# Altium schematic sheet 05_CSI_CAMERA.SchDoc: MIP CSI Camera Connector
size 297 x 209 mm; Author: T. Ludemann; SheetNumber: 5; SheetTotal: 5; DocSize: DINA4
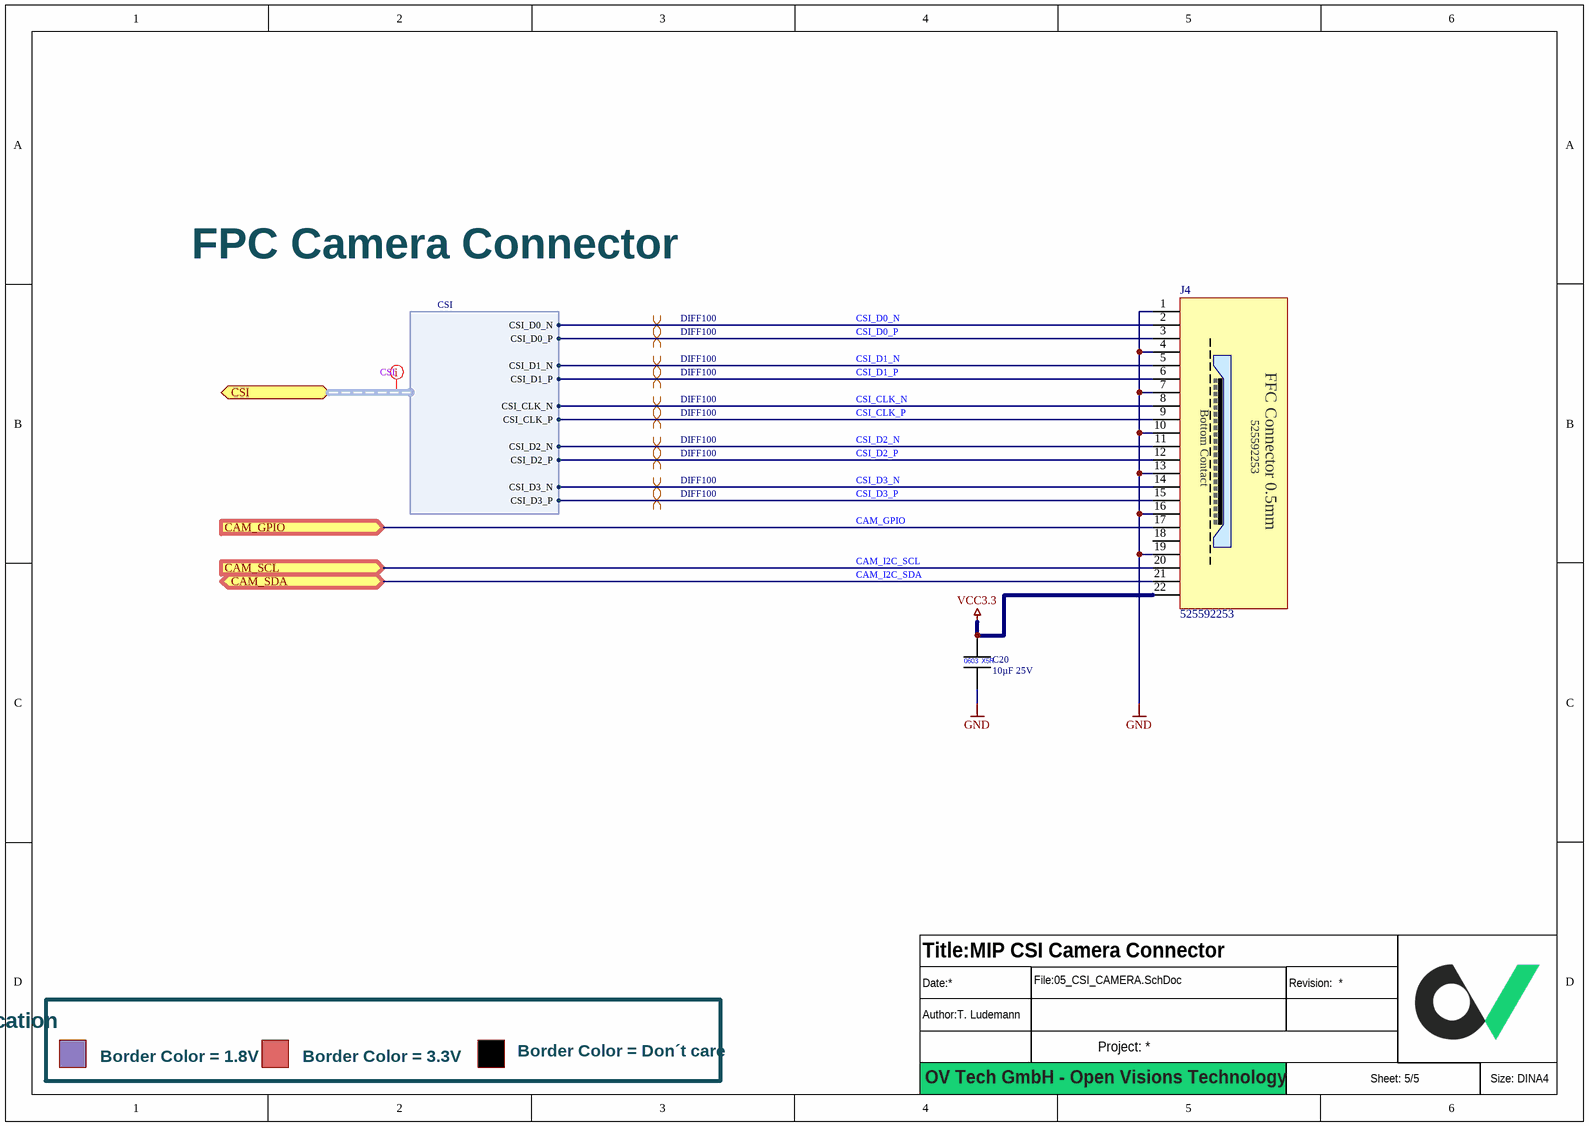
[diagram p0: 05_CSI_CAMERA.SchDoc]

## Parts
?  (no value)  (graphical)
C20  10µF 25V  [CAPC1608X10L]
J4  525592253  [FFC 22pol 0.5mm 525592253]

## Ports
CAM_GPIO (in), CAM_SCL (in), CAM_SDA (bidir), CSI (bidir, harness CSI)

## Harnesses
CSI: CSI_D0_N, CSI_D0_P, CSI_D1_N, CSI_D1_P, CSI_CLK_N, CSI_CLK_P, CSI_D2_N, CSI_D2_P, CSI_D3_N, CSI_D3_P

## Nets
GND: C20.2 J4.1 J4.4 J4.7 J4.10 J4.13 J4.16 J4.19
VCC3.3: C20.1 J4.22
CAM_GPIO: J4.17 ; port CAM_GPIO
CAM_I2C_SCL: J4.20 ; port CAM_SCL
CAM_I2C_SDA: J4.21 ; port CAM_SDA
CSI_CLK_N: J4.8 ; port CSI.CSI_CLK_N
CSI_CLK_P: J4.9 ; port CSI.CSI_CLK_P
CSI_D0_N: J4.2 ; port CSI.CSI_D0_N
CSI_D0_P: J4.3 ; port CSI.CSI_D0_P
CSI_D1_N: J4.5 ; port CSI.CSI_D1_N
CSI_D1_P: J4.6 ; port CSI.CSI_D1_P
CSI_D2_N: J4.11 ; port CSI.CSI_D2_N
CSI_D2_P: J4.12 ; port CSI.CSI_D2_P
CSI_D3_N: J4.14 ; port CSI.CSI_D3_N
CSI_D3_P: J4.15 ; port CSI.CSI_D3_P

Not connected (* = marked no-connect by the designer): J4 18

## Layout directives
net class CSI: (no net found under the mark)
differential pair; differential pair class DIFF100: CSI_CLK_N, CSI_CLK_P, CSI_D0_N, CSI_D0_P, CSI_D1_N, CSI_D1_P, CSI_D2_N, CSI_D2_P, CSI_D3_N, CSI_D3_P

## Notes on the sheet
- FPC Camera Connector
- Signal Level Indication
- Border Color = 1.8V
- Border Color = 3.3V
- Border Color = Don´t care
- OV Tech GmbH - Open Visions Technology
- (in symbol CAP_0603_10µ_25V) 0603; X5R
- (in symbol FFC Connector_22pol_525592253) FFC Connector 0.5mm; Bottom Contact

## Library data of the parts
? = Titleblock_01_OpenSource
C20 = CAP_0603_10µ_25V: Multilayer Ceramic Capacitors MLCC - SMD/SMT 0603 25VDC; Manufacturer 1: Murata Electronics; Manufacturer 1 Prt. Nr.: GRM188R61E106KA73J; Manufacturer 2 Prt. Nr.: CL10A106MA8NRNC; Manufacturer 2: Samsung Electro-Mechanics
J4 = FFC Connector_22pol_525592253: FFC Connector 22pol 0.5mm Pitch Vertical; Manufacturer 1: Molex; Manufacturer 1 Prt. Nr.: 525592253